# EAGLE schematic apo_board_2014 (EAGLE 7.6.0)
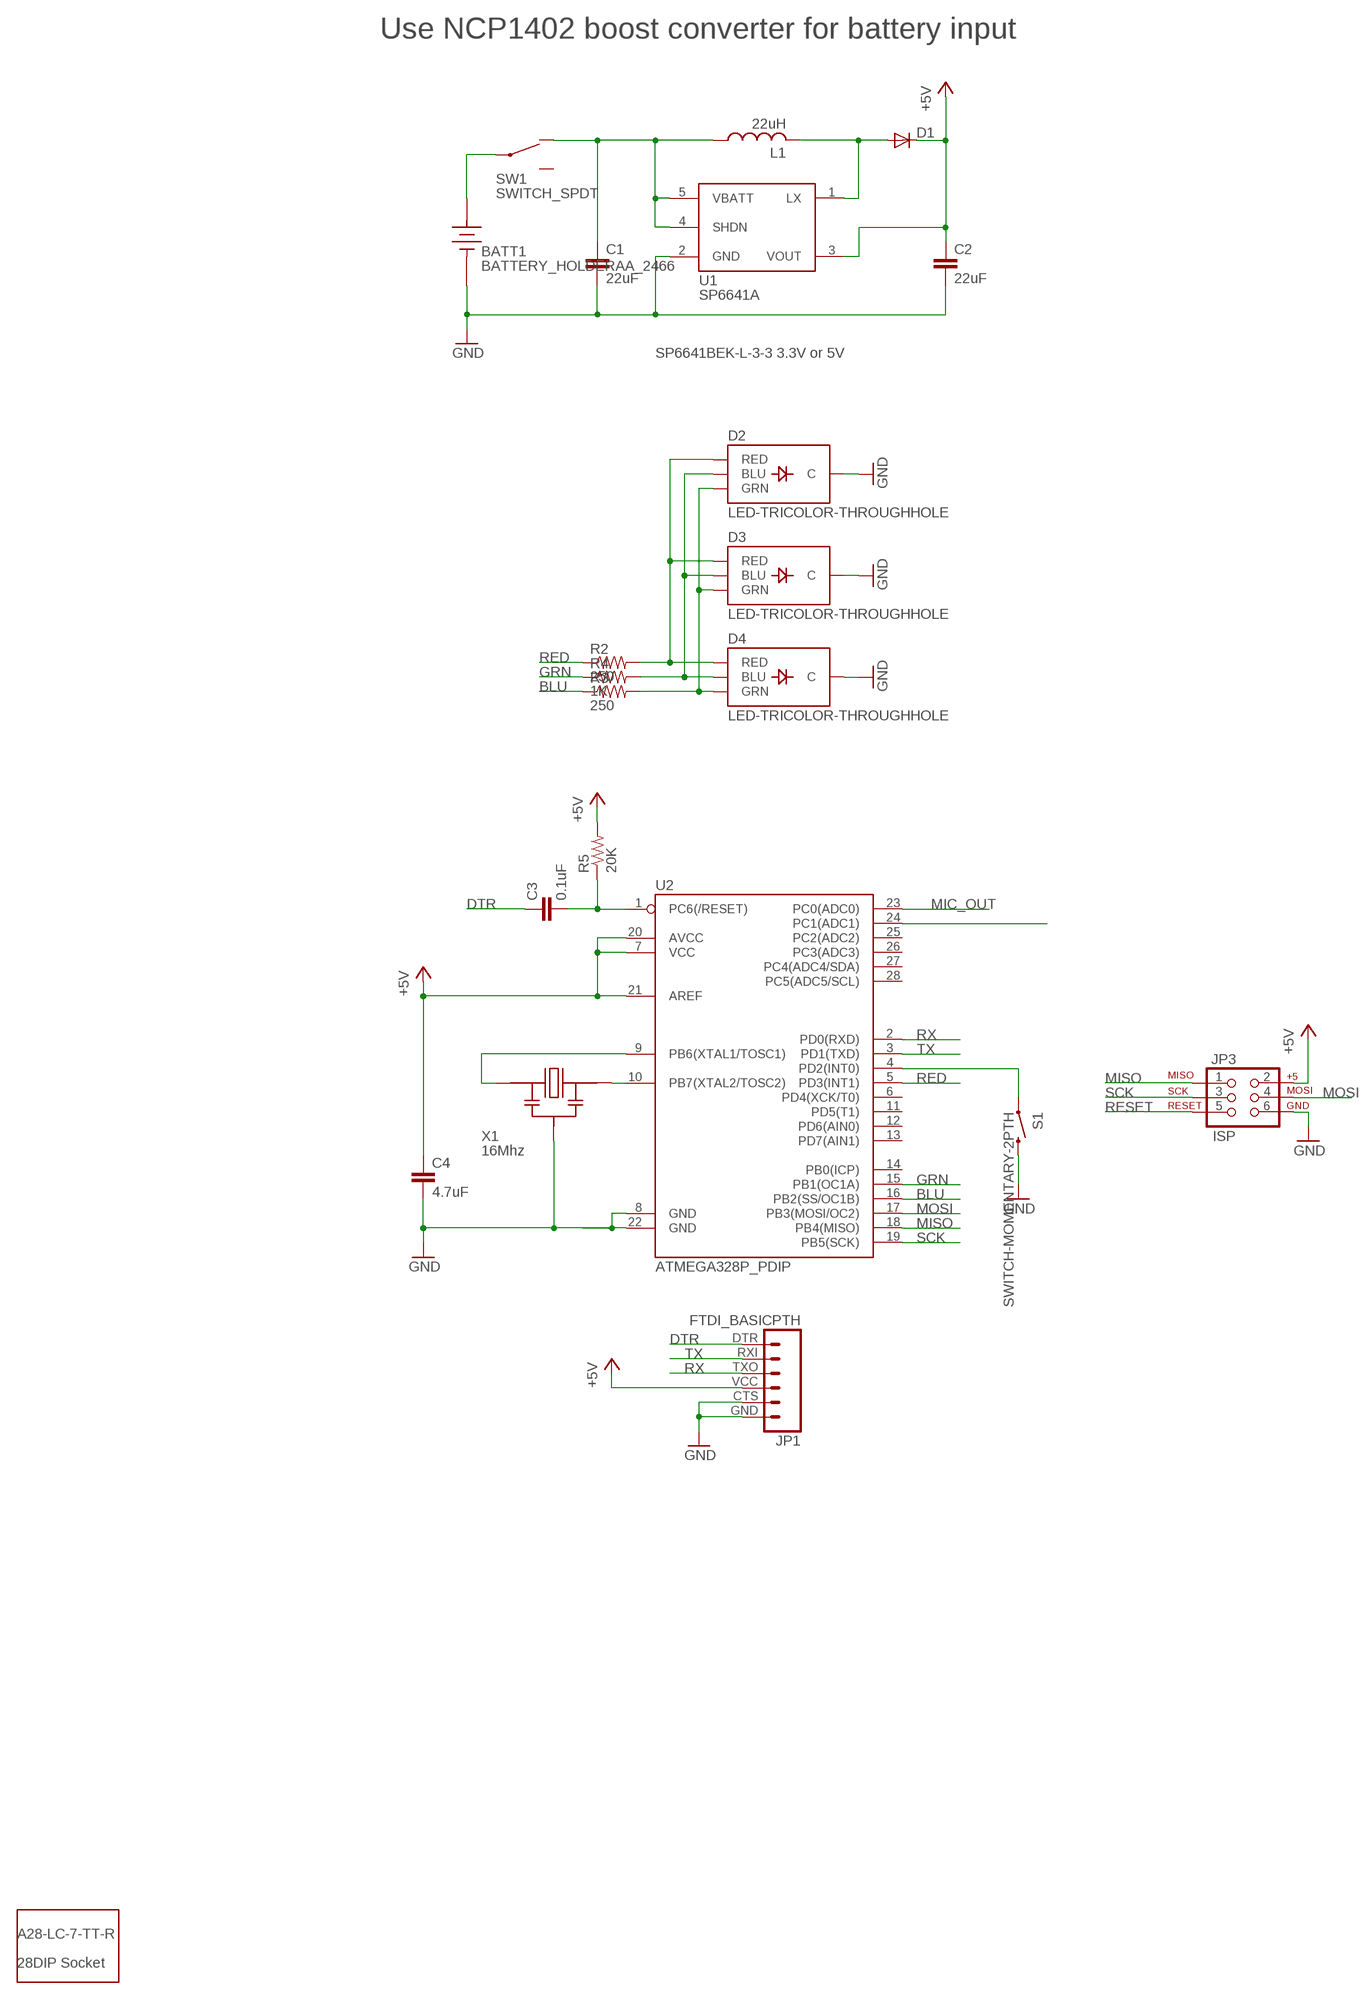
[diagram p0: schematic, sheet 1]

## Parts
BATT1  BATTERY_HOLDERAA_2466  [BATT_HOLDER_AA_2466]
C1  22uF  CAPKIT  [CAP-PTH-SMALL-KIT]
C2  22uF  CAPKIT  [CAP-PTH-SMALL-KIT]
C3  0.1uF  CAPKIT  [CAP-PTH-SMALL-KIT]
C4  4.7uF  CAPKIT  [CAP-PTH-SMALL-KIT]
D1  DIODEKIT  [DIODE-1N4148-KIT]
D2  LED-TRICOLOR-THROUGHHOLE  [LED-TRICOLOR-THROUGHHOLE]
D3  LED-TRICOLOR-THROUGHHOLE  [LED-TRICOLOR-THROUGHHOLE]
D4  LED-TRICOLOR-THROUGHHOLE  [LED-TRICOLOR-THROUGHHOLE]
JP1  FTDI_BASICPTH  [FTDI_BASIC]
JP3  ISP  AVR_SPI_PRG_6PTH  [2X3]
L1  22uH  INDUCTORAIUR-02H  [INDUCTOR_AIUR-02H]
R2  250  RESISTORKIT  [AXIAL-0.3-KIT]
R3  250  RESISTORKIT  [AXIAL-0.3-KIT]
R4  1K  RESISTORKIT  [AXIAL-0.3-KIT]
R5  20K  RESISTORKIT  [AXIAL-0.3-KIT]
S1  SWITCH-MOMENTARY-2PTH  [TACTILE-PTH]
SW1  SWITCH_SPDT  [SWITCH_SPDT_OS102011MA1QN1C]
U1  SP6641A  [SOT23-5]
U2  ATMEGA328P_PDIP  [DIL28-3]
X1  16Mhz  CERAMIC_RESONATOR  [CERAMIC_RESONATOR_ZTT]

## Nets
+5V: C2.1 C4.1 D1.C JP1.VCC JP3.2 R5.P$2 U1.3(VOUT) U2.7(VCC) U2.20(AVCC) U2.21(AREF)
BATT: BATT1.P SW1.P$2(COMMON)
BLU: R3.P$1 U2.16(PB2(SS/OC1B))
DTR: C3.1 JP1.DTR
GND: BATT1.N C1.2 C2.2 C4.2 D2.GND(C) D3.GND(C) D4.GND(C) JP1.CTS JP1.GND JP3.6 S1.3 U1.2(GND) U2.8(GND) U2.22(GND) X1.P$2
GRN: R4.P$1 U2.15(PB1(OC1A))
MIC_OUT: U2.23(PC0(ADC0))
MISO: JP3.1 U2.18(PB4(MISO))
MOSI: JP3.4 U2.17(PB3(MOSI/OC2))
N$1: U2.9(PB6(XTAL1/TOSC1)) X1.P$1
N$2: U2.10(PB7(XTAL2/TOSC2)) X1.P$3
N$3: S1.1 U2.4(PD2(INT0))
N$8: D2.GRN D3.GRN D4.GRN R3.P$2
N$9: D2.BLU D3.BLU D4.BLU R4.P$2
N$10: C3.2 R5.P$1 U2.1(PC6(/RESET))
N$12: U2.24(PC1(ADC1))
N$13: D2.RED D3.RED D4.RED R2.P$2
N$14: D1.A L1.P$2 U1.1(LX)
N$16: C1.1 L1.P$1 SW1.P$3 U1.4(SHDN) U1.5(VBATT)
RED: R2.P$1 U2.5(PD3(INT1))
RESET: JP3.5
RX: JP1.TXO U2.2(PD0(RXD))
SCK: JP3.3 U2.19(PB5(SCK))
TX: JP1.RXI U2.3(PD1(TXD))
Unconnected: SW1.P$1 U2.6(PD4(XCK/T0)) U2.11(PD5(T1)) U2.12(PD6(AIN0)) U2.13(PD7(AIN1)) U2.14(PB0(ICP)) U2.25(PC2(ADC2)) U2.26(PC3(ADC3)) U2.27(PC4(ADC4/SDA)) U2.28(PC5(ADC5/SCL))

## Notes on the sheet
- Use NCP1402 boost converter for battery input
- SP6641BEK-L-3-3 3.3V or 5V

## Library data of the parts
BATT1 = 1_BES_ELECTROMECHANICAL:BATTERY_HOLDER
C1-C4 = SparkFun-Passives:CAP: Capacitor Standard 0603 ceramic capacitor, and 0.1" leaded capacitor.
D1 = SparkFun-DiscreteSemi:DIODE: Diode These are standard reverse protection diodes and small signal diodes. SMA package can handle up to about 1A. SOD-323 can handle about 200mA. What the SOD-323 package when ordering, there are some mfgs out there that are 5-pin packages.
D2-D4 = SparkFun:LED-TRICOLOR-THROUGHHOLE
JP1 = SparkFun-Connectors:FTDI_BASIC: FTDI Basic header with labels
JP3 = SparkFun:AVR_SPI_PRG_6: AVR ISP 6 Pin This is the reduced ISP connector for AVR programming. Common on Arduino. This footprint will take up less PCB space and can be used with a 10-pin to 6-pin adapter such as SKU: BOB-08508
L1 = 1_Dan Master:INDUCTOR: SMT Inductor
R2-R5 = SparkFun-Passives:RESISTOR: Resistor Basic schematic elements and footprints for 0603, 1206, and PTH resistors.
S1 = SparkFun:SWITCH-MOMENTARY-2
SW1 = 1_Dan Master:SWITCH_SPDT
U1 = 1_Dan Master:SP6641A
U2 = SparkFun-DigitalIC:ATMEGA328P_PDIP: uC used in the Arduino 32kb flash, 1k EEPROM, 2k SRAM This is the through-hole version of this chip.
X1 = 1_Dan Master:CERAMIC_RESONATOR

## Net classes
0 default: width 0.203 mm
1 vcc: width 0.254 mm